# Altium schematic sheet Top_Level.SchDoc
size A4; SheetNumber: 1; SheetTotal: 2
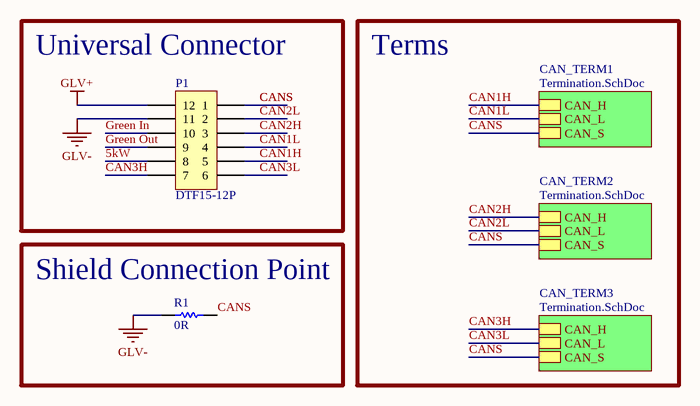
[diagram p0: Top_Level.SchDoc]

## Parts
P1  DTF15-12P  [DTF15-12P]
R1  0R  [0805]

## Blocks framed on the sheet
Universal Connector: P1
Shield Connection Point: R1

## Sub-sheets
CAN_TERM1 = Termination.SchDoc: CAN_H, CAN_L, CAN_S
CAN_TERM2 = Termination.SchDoc: CAN_H, CAN_L, CAN_S
CAN_TERM3 = Termination.SchDoc: CAN_H, CAN_L, CAN_S

## Nets
GLV+: P1.12
GLV-: P1.11 R1.1
5kW: P1.8
CAN1H: P1.5 ; sheet CAN_TERM1/CAN_H
CAN1L: P1.4 ; sheet CAN_TERM1/CAN_L
CAN2H: P1.3 ; sheet CAN_TERM2/CAN_H
CAN2L: P1.2 ; sheet CAN_TERM2/CAN_L
CAN3H: P1.7 ; sheet CAN_TERM3/CAN_H
CAN3L: P1.6 ; sheet CAN_TERM3/CAN_L
CANS: P1.1 R1.2 ; sheet CAN_TERM1/CAN_S, sheet CAN_TERM2/CAN_S, sheet CAN_TERM3/CAN_S
Green In: P1.10
Green Out: P1.9

## Notes on the sheet
- Terms

## Library data of the parts
P1 = DTF15-12P[[/\]]DTF15-12P: Positions: 12; Pitch: 4.44mm; Row Spacing: 9.12 mm; Angle: 0; Flange: No; Contact: Copper Alloy; Part Number: DTF15-12P; Digikey Part Number: 1734-1647-ND; Digikey Link: https://www.digikey.com.au/product-detail/en/te-connectivity-deutsch-connectors/DTF15-12PA/1734-1647-ND/7220164
R1 = RC0805FR070RL: DNP; Manufacturer: YAGEO; Tolerance: 0.01; Rated Voltage: 0.125W; Part Number: RC0805FR070RL; Value: 0R; Material: FR-07; Digikey Part Number: 311-0.0CRCT-ND